# EAGLE schematic Fuse Tree (EAGLE 9.3.0)
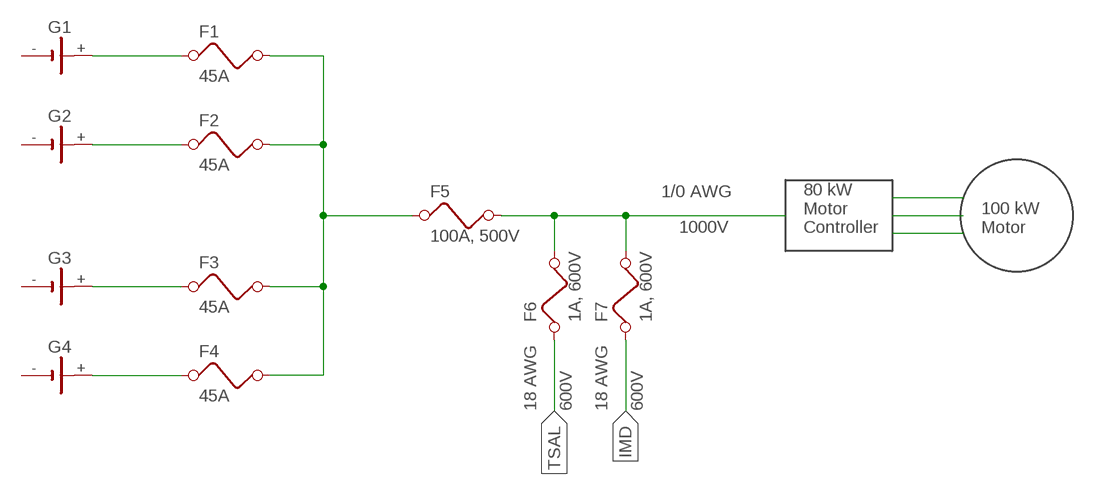
[diagram p0: schematic, sheet 1]

## Parts
F1  45A  FUSE  [FUSE]
F2  45A  FUSE  [FUSE]
F3  45A  FUSE  [FUSE]
F4  45A  FUSE  [FUSE]
F5  100A, 500V  FUSE  [FUSE]
F6  1A, 600V  FUSE  [FUSE]
F7  1A, 600V  FUSE  [FUSE]
G1  SL-160AA/PR  [SL-160AA/PR]
G2  SL-160AA/PR  [SL-160AA/PR]
G3  SL-160AA/PR  [SL-160AA/PR]
G4  SL-160AA/PR  [SL-160AA/PR]

## Nets
IMD: F7.1
N$1: F1.1 G1.+
N$2: F2.1 G2.+
N$3: F3.1 G3.+
N$4: F4.1 G4.+
N$5: F1.2 F2.2 F3.2 F4.2 F5.1
N$6: F5.2 F6.2 F7.2
TSAL: F6.1
Unconnected: G1.- G2.- G3.- G4.-

## Notes on the sheet
- 1/0 AWG
- 1000V
- 80 kW
  Motor
  Controller
- 100 kW
  Motor
- 18 AWG | 600V | 18 AWG | 600V

## Library data of the parts
F1-F7 = special:FUSE: FUSE 5 x 20 mm
G1-G4 = battery:SL-160AA/PR: LI BATTERY Sonnenschein